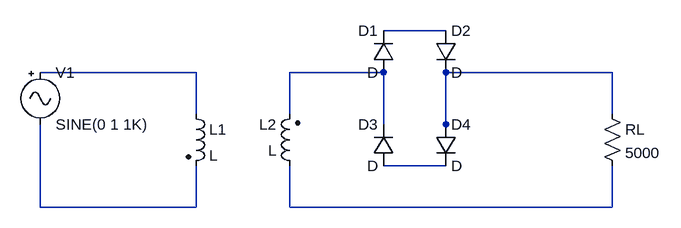
[diagram p0: schematic Draft2.asc]
Draft2.asc, the LTspice schematic file:
Version 4
SHEET 1 932 680
WIRE 592 80 496 80
WIRE 208 144 -32 144
WIRE 496 144 352 144
WIRE 848 144 592 144
WIRE 208 208 208 144
WIRE 352 208 352 144
WIRE 848 208 848 144
WIRE 496 224 496 144
WIRE 592 224 592 144
WIRE 592 240 592 224
WIRE 592 288 496 288
WIRE -32 352 -32 224
WIRE 208 352 208 288
WIRE 208 352 -32 352
WIRE 352 352 352 288
WIRE 848 352 848 288
WIRE 848 352 352 352
SYMBOL Misc\\signal -32 128 R0
SYMATTR InstName V1
SYMBOL ind2 192 192 R0
SYMATTR InstName L1
SYMBOL ind2 368 304 R180
WINDOW 0 36 80 Left 2
WINDOW 3 36 40 Left 2
SYMATTR InstName L2
SYMBOL diode 512 144 R180
WINDOW 0 24 64 Left 2
WINDOW 3 24 0 Left 2
SYMATTR InstName D1
SYMBOL diode 576 80 R0
SYMATTR InstName D2
SYMBOL diode 512 288 R180
WINDOW 0 24 64 Left 2
WINDOW 3 24 0 Left 2
SYMATTR InstName D3
SYMBOL diode 576 224 R0
SYMATTR InstName D4
SYMBOL res 832 192 R0
SYMATTR InstName RL
SYMATTR Value 5000

The netlist it stands for:
* Draft2.asc
V1 N002 N006 SINE(0 1 1K)
L1 N002 N006 L
L2 N007 N003 L
D1 N003 N001 D
D2 N001 N004 D
D3 N005 N003 D
D4 N004 N005 D
RL N004 N007 5000
.model D D
.lib standard.dio
.backanno
.end